# EasyEDA Pro project ProPrj_LM324前级放大TDA2030A双电源功放.epro

# Schematic Schematic1
Board Name: Board1; Create Date: 2025-03-01; Page Name: P1; Project Name: 模电实验功放000; Schematic Name: Schematic1; Update Date: 2025-03-10; Company: 嘉立创EDA; Page Size: A4; Version: V1.0
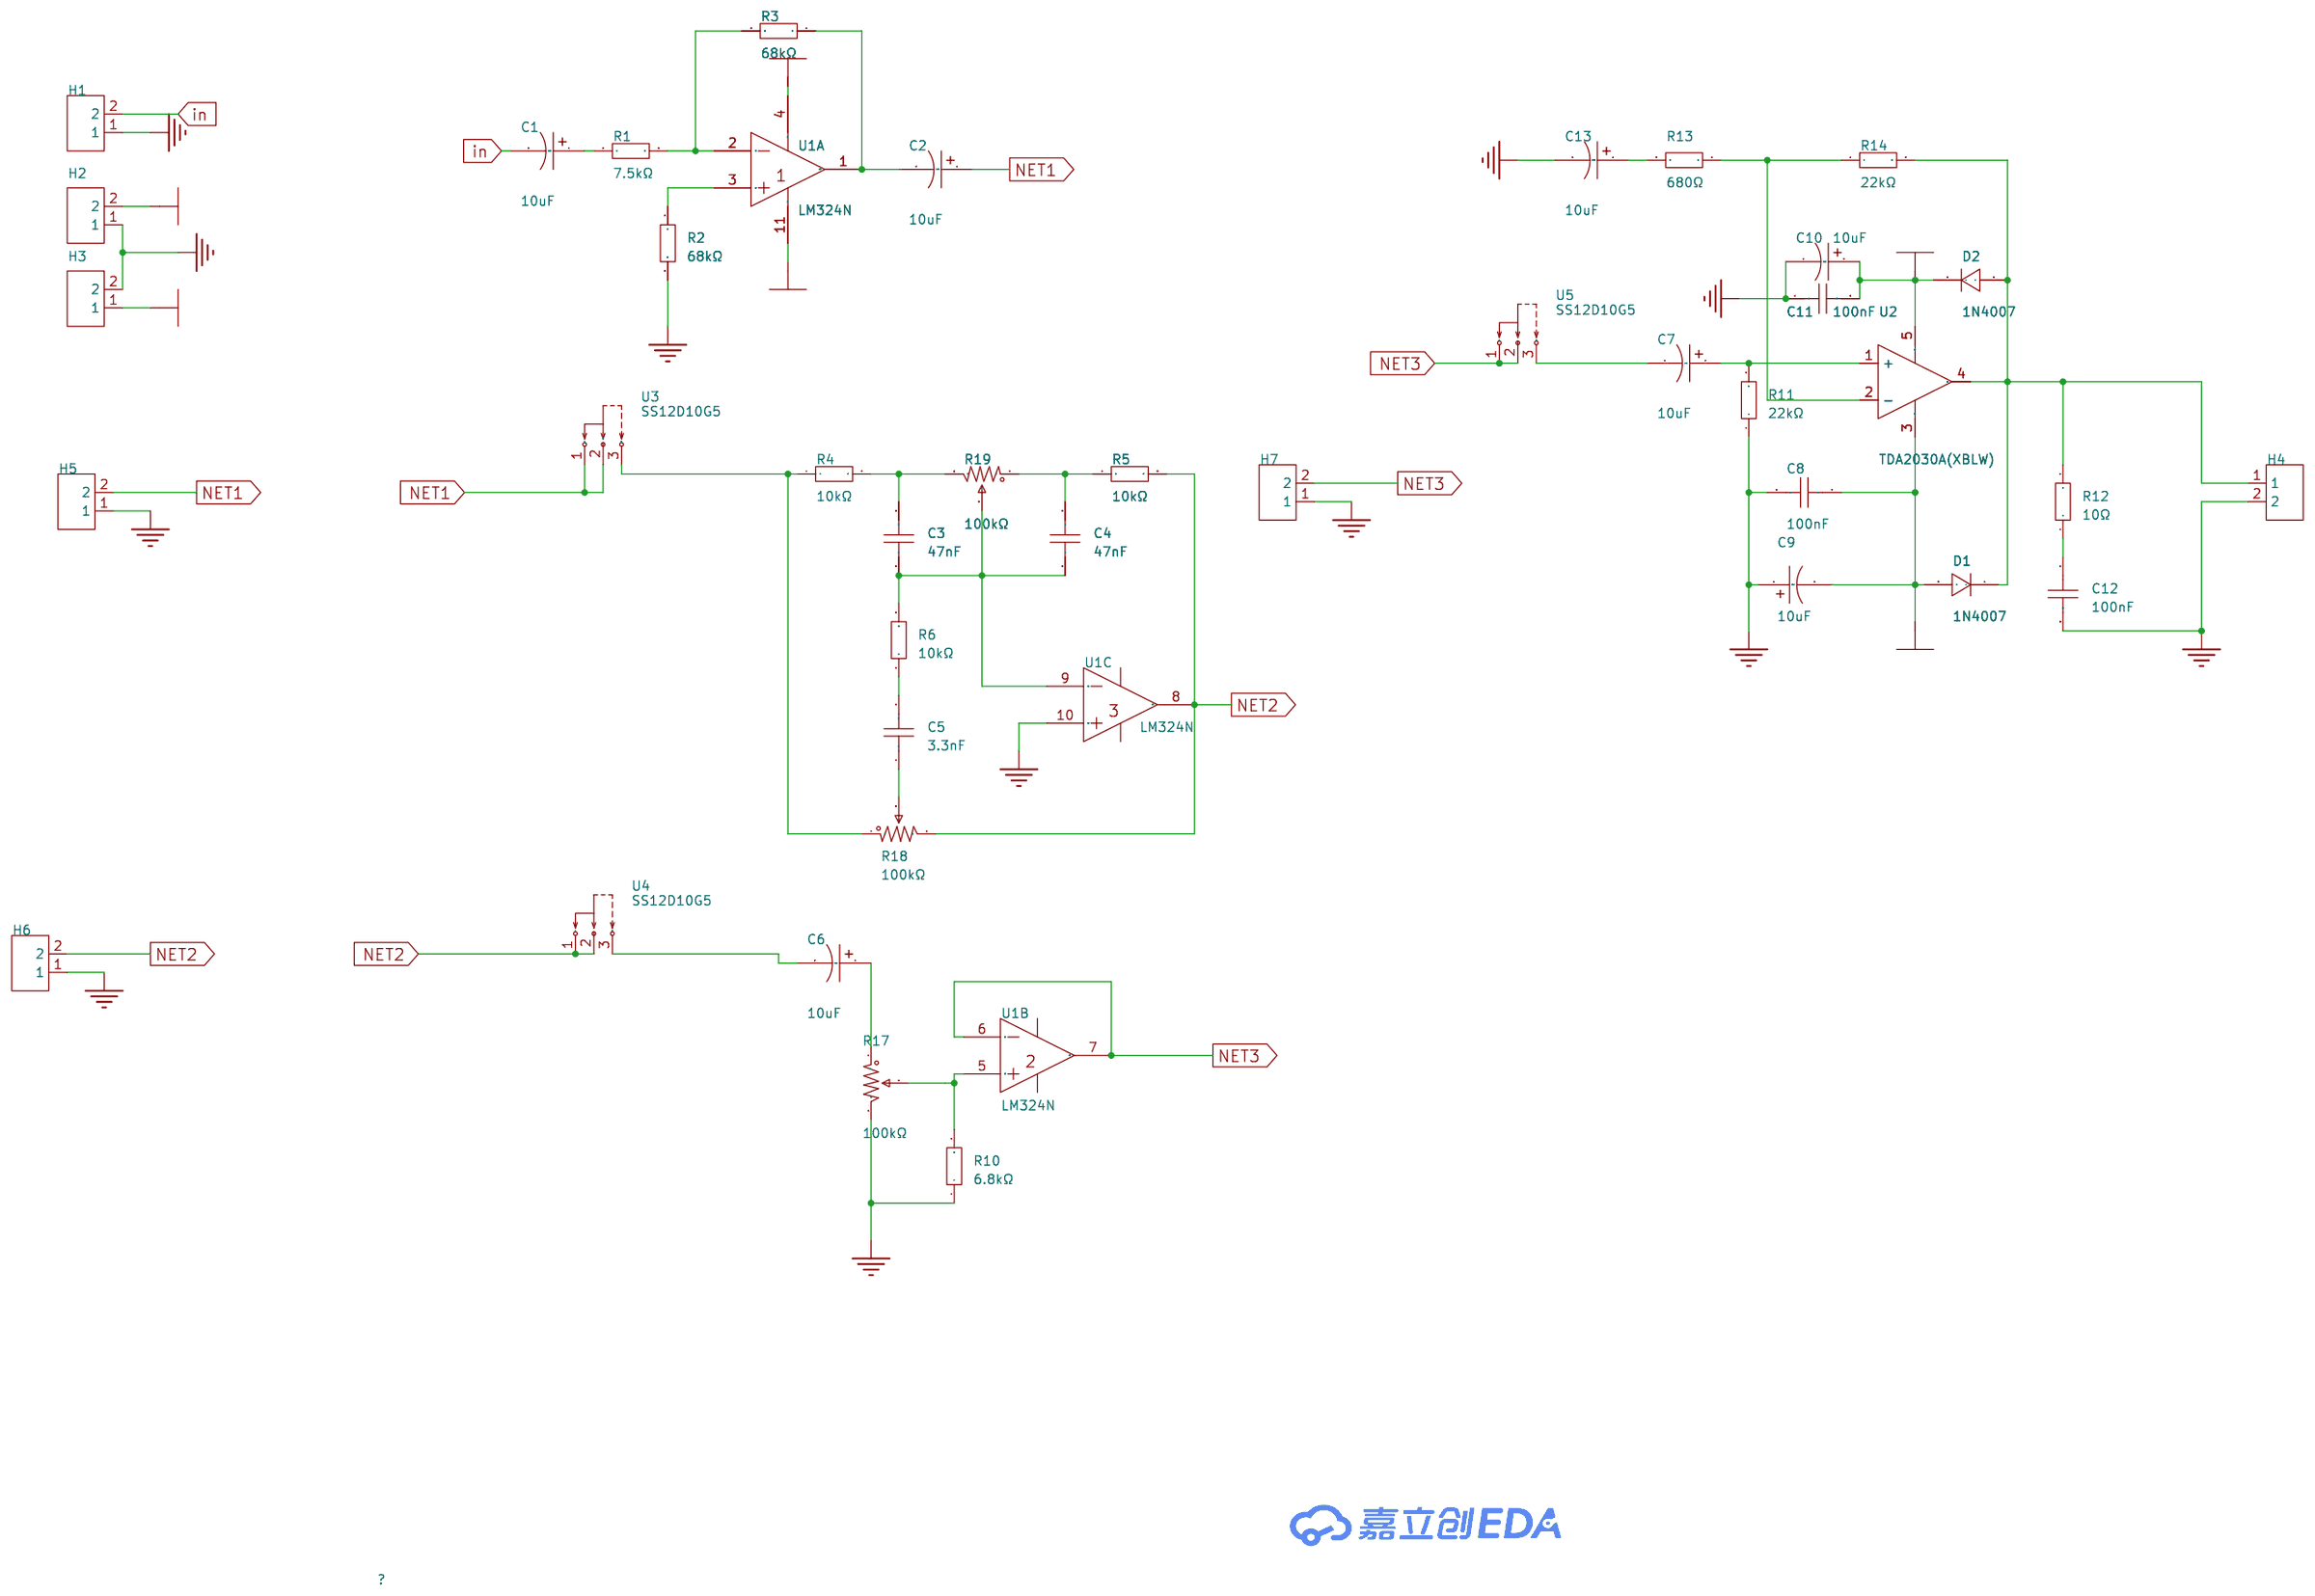
[diagram p0: schematic sheet]

## Parts
C1  10uF  [CAP-TH_BD5.0-P2.00-D0.8-FD]
C2  10uF  [CAP-TH_BD5.0-P2.00-D0.8-FD]
C3  47nF  [CAP-TH_L4.0-W2.6-P5.08-D0.5]
C4  47nF  [CAP-TH_L4.0-W2.6-P5.08-D0.5]
C5  3.3nF  [CAP-TH_L8.5-W5.0-P5.00-D1.2]
C6  10uF  [CAP-TH_BD5.0-P2.00-D0.8-FD]
C7  10uF  [CAP-TH_BD5.0-P2.00-D0.8-FD]
C8  100nF  [CAP-TH_L4.8-W2.4-P5.08-D0.6]
C9  10uF  [CAP-TH_BD5.0-P2.00-D0.8-FD]
C10  10uF  [CAP-TH_BD5.0-P2.00-D0.8-FD]
C11  100nF  [CAP-TH_L4.8-W2.4-P5.08-D0.6]
C12  100nF  [CAP-TH_L4.8-W2.4-P5.08-D0.6]
C13  10uF  [CAP-TH_BD5.0-P2.00-D0.8-FD]
D1  1N4007  [RES-TH_BD2.7-L6.2-P10.20-D0.4]
D2  1N4007  [RES-TH_BD2.7-L6.2-P10.20-D0.4]
H1  PZ254V-11-02P  [HDR-TH_2P-P2.54-V-M]
H2  PZ254V-11-02P  [HDR-TH_2P-P2.54-V-M]
H3  PZ254V-11-02P  [HDR-TH_2P-P2.54-V-M]
H4  PZ254V-11-02P  [HDR-TH_2P-P2.54-V-M]
H5  PZ254V-11-02P  [HDR-TH_2P-P2.54-V-M]
H6  PZ254V-11-02P  [HDR-TH_2P-P2.54-V-M]
H7  PZ254V-11-02P  [HDR-TH_2P-P2.54-V-M]
R1  7.5kΩ  [RES-TH_BD2.3-L3.7-P7.70-D0.9]
R2  68kΩ  [RES-TH_BD2.2-L6.5-P10.50-D0.6]
R3  68kΩ  [RES-TH_BD2.2-L6.5-P10.50-D0.6]
R4  10kΩ  [RES-TH_BD2.7-L6.2-P10.20-D0.4]
R5  10kΩ  [RES-TH_BD2.7-L6.2-P10.20-D0.4]
R6  10kΩ  [RES-TH_BD2.7-L6.2-P10.20-D0.4]
R10  6.8kΩ  [RES-TH_BD2.7-L6.2-P10.20-D0.4]
R11  22kΩ  [RES-TH_BD2.3-L3.7-P7.70-D0.9]
R12  10Ω  [RES-TH_BD2.3-L3.7-P7.70-D0.9]
R13  680Ω  [RES-TH_BD2.3-L3.7-P7.70-D0.9]
R14  22kΩ  [RES-TH_BD2.3-L3.7-P7.70-D0.9]
R17  100kΩ  [RES-ADJ-TH_3362P]
R18  100kΩ  [RES-ADJ-TH_3362P]
R19  100kΩ  [RES-ADJ-TH_3362P]
U1  LM324N  [DIP-14_L19.4-W6.4-P2.54-LS7.6-BL]  (sections 1,2,3)
U2  TDA2030A(XBLW)  [TO-220-5_L10.5-W15.5-P1.70-TL]
U3  SS12D10G5  [SW-TH_SHOU-HAN_SS12D10G4]
U4  SS12D10G5  [SW-TH_SHOU-HAN_SS12D10G4]
U5  SS12D10G5  [SW-TH_SHOU-HAN_SS12D10G4]

## Library data of the parts
C1 C2 C6 C7 C9 C10 C13 = ERS1HM100D11OT: 容值:10uF;精度:±20%;额定电压:50V;; LCSC Part Name: 10uF ±20% 50V; Supplier Part: C106654; Manufacturer: AISHI(艾华集团); Supplier Footprint: 插件,D5xL11mm; JLCPCB Part Class: Extended Part; Datasheet: https://atta.szlcsc.com/upload/public/pdf/source/20191015/C438940_4B8E60A742BB0AE40DDEF87A5C89089D.pdf; Supplier: LCSC; Tolerance: ±20%; Rated Voltage: 50V; Lead Spacing: 2mm; φD: 5mm; L: 11mm; Lifetime @ Temp: 5000hrs@105℃; Equivalent Series Resistance(ESR): 500mΩ@100kHz; Operating Temperature: -55℃~+105℃
C3 C4 = CD1H473KC9BER1E100: 容值:47nF;精度:±10%;额定电压:50V;温度系数:X7R;; LCSC Part Name: 47nF ±10% 50V; Supplier Part: C19712483; Manufacturer: Dersonic(德尔创); Supplier Footprint: 插件,P=5.08mm; JLCPCB Part Class: Extended Part; Datasheet: https://atta.szlcsc.com/upload/public/pdf/source/20231222/1AD6C5910103EA7ED9DC4C331866E9F8.pdf; Supplier: LCSC; Tolerance: ±10%; Voltage Rated: 50V; Temperature Coefficient: X7R
C5 = CT4-0805B332K500F3: 容值:3.3nF;精度:±10%;额定电压:50V;温度系数:X7R;; LCSC Part Name: 3.3nF ±10% 50V; Supplier Part: C94707; Manufacturer: FH(风华); Supplier Footprint: 插件,P=5.08mm; JLCPCB Part Class: Extended Part; Datasheet: https://atta.szlcsc.com/upload/public/pdf/source/20190402/C385200_059806A6312B28FF1421A2413EB641E1.pdf; Supplier: LCSC; Tolerance: ±10%; Voltage Rated: 50V; Temperature Coefficient: X7R
C8 C11 C12 = 178MU0013: 容值:100nF;精度:±10%;额定电压:50V;温度系数:X7R;; LCSC Part Name: 100nF ±10% 50V; Supplier Part: C5632437; Manufacturer: KNSCHA(科尼盛); Supplier Footprint: 插件,P=5.08mm; JLCPCB Part Class: Extended Part; Datasheet: https://atta.szlcsc.com/upload/public/pdf/source/20230506/C9B890CA552EFD22DFE029978FA4CE55.pdf; Supplier: LCSC; Tolerance: ±10%; Voltage Rated: 50V; Temperature Coefficient: X7R
D1 D2 = 1N4007_C360242: 二极管配置:独立式;正向压降(Vf):1V@1A;直流反向耐压(Vr):1kV;平均整流电流(Io):1A;; LCSC Part Name: 电压:1kV 电流:1A; Supplier Part: C360242; Manufacturer: PINGWEI(平伟); Supplier Footprint: DO-41; JLCPCB Part Class: Extended Part; Datasheet: https://atta.szlcsc.com/upload/public/pdf/source/20190311/C360242_0570B0757C9812815F2FE32FDEDB861A.pdf; Supplier: LCSC; Diode Configuration: 独立式; Forward Voltage (Vf@If): 1V@1A; Reverse Voltage (Vr): 1kV; Average Rectified Current (Io): 1A; Reverse Leakage Current: 5uA@1kV
H1-H7 = PZ254V-11-02P: 插针结构:1x2P;间距:2.54mm;行距:-;圆针/方针:方针;安装方式:直插;排数:单排;总PIN位数:2P;额定电流:-;额定电压:-;配合针长度:6mm;塑高:2.5mm;端接针长度:3mm;触头材质:黄铜;触头镀层:-;工作温度:-40℃~+105℃;颜色:黑色;; LCSC Part Name: 1x2P 间距:2.54mm 方针 直插; Supplier Part: C492401; Manufacturer: XFCN(兴飞); Supplier Footprint: 插件,P=2.54mm; JLCPCB Part Class: 扩展库; Datasheet: https://atta.szlcsc.com/upload/public/pdf/source/20200309/C492401_A812433581A9B211A7FFA413ADDFF0E5.pdf; Supplier: LCSC; Pin Structure: 1x2P; Pitch: 2.54mm; Circluar Pins/Square Pins: 方针; Mounting Type: 直插; Number of Rows: 单排; Number of Pins: 2P; Length of Mating Pin: 6mm; Insulation Height: 2.5mm; Length of End Connection Pin: 3mm; Contact Material: 黄铜; Operating Temperature: -40℃~+105℃; Color: 黑色
R1 = MF1/8W-7K5±1%-ST52: 电阻类型:金属膜电阻;阻值:7.5kΩ;精度:±1%;功率:125mW;温度系数:±100ppm/℃;; LCSC Part Name: 金属膜电阻 7.5kΩ ±1% 125mW; Supplier Part: C2903370; Manufacturer: VO(翔胜); Supplier Footprint: 插件,D2.3xL3.7mm; JLCPCB Part Class: Extended Part; Datasheet: https://atta.szlcsc.com/upload/public/pdf/source/20200609/C601728_5AA4C0C8E12E11069DA2C3356F29D1F2.pdf; Supplier: LCSC; Type: 金属膜电阻; Tolerance: ±1%; Overload Voltage (Max): 200V; Power(Watts): 125mW; Temperature Coefficient: ±100ppm/℃; Operating Temperature Range: -55℃~+155℃
R2 R3 = MF1/4W-68K ±1%-ST52: 电阻类型:金属膜电阻;阻值:68kΩ;精度:±1%;功率:250mW;温度系数:±350ppm/℃;; LCSC Part Name: 金属膜电阻 68kΩ ±1% 250mW; Supplier Part: C337161; Manufacturer: VO(翔胜); Supplier Footprint: 插件,D2.7xL6.2mm; JLCPCB Part Class: Extended Part; Datasheet: https://atta.szlcsc.com/upload/public/pdf/source/20181214/C337186_A148C7E222202906AB7599B538FD7985.pdf; Supplier: LCSC; Type: 金属膜电阻; Tolerance: ±1%; Overload Voltage (Max): 250V; Power(Watts): 250mW; Temperature Coefficient: ±350ppm/℃; Operating Temperature Range: -55℃~+155℃
R4-R6 = MF1/4W-10K±1%-ST52: 电阻类型:金属膜电阻;阻值:10kΩ;精度:±1%;功率:250mW;温度系数:±100ppm/℃;; LCSC Part Name: 金属膜电阻 10kΩ ±1% 250mW; Supplier Part: C2903232; Manufacturer: VO(翔胜); Supplier Footprint: 插件,D2.7xL6.2mm; JLCPCB Part Class: Extended Part; Datasheet: https://atta.szlcsc.com/upload/public/pdf/source/20200609/C601728_5AA4C0C8E12E11069DA2C3356F29D1F2.pdf; Supplier: LCSC; Type: 金属膜电阻; Tolerance: ±1%; Overload Voltage (Max): 250V; Power(Watts): 250mW; Temperature Coefficient: ±100ppm/℃; Operating Temperature Range: -55℃~+155℃
R10 = CR1/4W-6K8±5%-ST26: 电阻类型:碳膜电阻;阻值:6.8kΩ;精度:±5%;功率:250mW;温度系数:±350ppm/℃;; LCSC Part Name: 碳膜电阻 6.8kΩ ±5% 250mW; Supplier Part: C2896892; Manufacturer: VO(翔胜); Supplier Footprint: 插件,D2.7xL6.2mm; JLCPCB Part Class: Extended Part; Datasheet: https://atta.szlcsc.com/upload/public/pdf/source/20210803/C2857407_45FF53FE186CAB545115AD37303966CD.pdf; Supplier: LCSC; Type: 碳膜电阻; Tolerance: ±5%; Overload Voltage (Max): 250V; Power(Watts): 250mW; Temperature Coefficient: ±350ppm/℃; Operating Temperature Range: -55℃~+155℃
R11 R14 = MF1/8W ±1% 22K OTB5: 电阻类型:金属膜电阻;阻值:22kΩ;精度:±1%;温度系数:±100ppm/℃;; LCSC Part Name: 金属膜电阻 22kΩ ±1%; Supplier Part: C337062; Manufacturer: VO(翔胜); Supplier Footprint: 插件,D2.3xL3.7mm; JLCPCB Part Class: Extended Part; Datasheet: https://atta.szlcsc.com/upload/public/pdf/source/20181214/C337186_A148C7E222202906AB7599B538FD7985.pdf; Supplier: LCSC; Type: 金属膜电阻; Tolerance: ±1%; Temperature Coefficient: ±100ppm/℃; Power(Watts): 100mW; Overload Voltage (Max): 75V; Operating Temperature Range: -55℃~+155℃
R12 = MF1/8W-10Ω±1%-OT52: 电阻类型:金属膜电阻;阻值:10Ω;精度:±1%;功率:125mW;温度系数:±350ppm/℃;; LCSC Part Name: 金属膜电阻 10Ω ±1% 125mW; Supplier Part: C2848559; Manufacturer: VO(翔胜); Supplier Footprint: 插件,D2.3xL3.7mm; JLCPCB Part Class: Extended Part; Datasheet: https://atta.szlcsc.com/upload/public/pdf/source/20190910/C427326_62A6D058BC0FF74963A2F22379CA06CE.pdf; Supplier: LCSC; Type: 金属膜电阻; Tolerance: ±1%; Overload Voltage (Max): 200V; Power(Watts): 125mW; Temperature Coefficient: ±350ppm/℃; Operating Temperature Range: -55℃~+155℃; Voltage-Supply(Max): 500V; Operating Temperature: -55℃~+155℃
R13 = MF1/8W-680Ω±1%-ST52: 电阻类型:金属膜电阻;阻值:680Ω;精度:±1%;功率:125mW;温度系数:±350ppm/℃;; LCSC Part Name: 金属膜电阻 680Ω ±1% 125mW; Supplier Part: C2848573; Manufacturer: VO(翔胜); Supplier Footprint: 插件,D2.3xL3.7mm; JLCPCB Part Class: Extended Part; Datasheet: https://atta.szlcsc.com/upload/public/pdf/source/20200609/C601728_5AA4C0C8E12E11069DA2C3356F29D1F2.pdf; Supplier: LCSC; Type: 金属膜电阻; Tolerance: ±1%; Overload Voltage (Max): 200V; Power(Watts): 125mW; Temperature Coefficient: ±350ppm/℃; Operating Temperature Range: -55℃~+155℃
R17-R19 = 3362P-1-104: 阻值:100kΩ;精度:±10%;; LCSC Part Name: 100kΩ ±10%; Supplier Part: C118966; Manufacturer: BOCHEN(博晨); Supplier Footprint: 插件; JLCPCB Part Class: Extended Part; Datasheet: https://atta.szlcsc.com/upload/public/pdf/source/20171114/C118966_15106326666201117452.pdf; Supplier: LCSC; Tolerance: ±10%; Power(Watts): 100mW
U1 = LM324N_C725320: 运放类型:-;放大器组数:-;增益带宽积（GBP）:-;压摆率（SR）:-;电源电压:-;各通道供电电流:-;; LCSC Part Name: 四路运算放大器; Supplier Part: C725320; Manufacturer: HGSEMI(华冠); Supplier Footprint: DIP-14; JLCPCB Part Class: Extended Part; Datasheet: https://atta.szlcsc.com/upload/public/pdf/source/20200820/C725320_F412C3792749730AA8E5D3FBC02E9B6A.pdf; Supplier: LCSC
U2 = TDA2030A(XBLW): 音频功率放大器   18W音频放大器，工作电压：44V，输出电流4.5A; Supplier Part: C19267476; Manufacturer: XBLW(芯伯乐); Supplier Footprint: TO-220B; JLCPCB Part Class: Extended Part; Datasheet: https://atta.szlcsc.com/upload/public/pdf/source/20231127/7A1903075705428C96FAEB39CDCE1C16.pdf; Supplier: LCSC; Supply Voltage: 44V; Type of Power Amplifier: AB类功放; Speaker Channels: 单声道; Output Power: 12Wx1@8Ω; Type: Class AB; Output Type: 1-Channel (Mono); Max Output Power x Channels @ Load: 12W x 1 @ 8Ω; Voltage - Supply: ±6V ~ 22V; Features: 热保护,短路保护
U3-U5 = SS12D10G5: 电路结构:单刀双掷;安装方式:直插;额定电流(DC):2A;额定电压(DC):125V;机械寿命:3千次;; LCSC Part Name: 两档立式插件 3脚拨动开关 柄长5.0mm; Supplier Part: C7431054; Manufacturer: SHOU HAN(首韩); Supplier Footprint: 插件; JLCPCB Part Class: 扩展库; Datasheet: https://atta.szlcsc.com/upload/public/pdf/source/20231130/7A3DB6A149BF0A1DCFFE64FFC07FE434.pdf; Supplier: LCSC; Circuit: 单刀双掷; Switch Length: 12.7mm; Switch Width: 6.7mm; Mounting Style: 直插; Current Rating (DC): 2A; Voltage Rating (DC): 125V; Mechanical Life: 3千次; Operating Temperature: -25℃~+70℃

## Nets
+VCC: C10.1 C11.2 D2.1(-) H2.2 U1.4(VCC) U2.5(VCC+)
-VCC: C8.1 C9.2 D1.2(+) H3.1 U1.11(GND) U2.3(GND)
GND: C8.2 C9.1 C10.2 C11.1 C12.2 C13.2 H1.1 H2.1 H3.2 H4.2 H5.1 H6.1 H7.1 R2.2 R10.1 R11.1 R17.3 U1.10(IN3+)
in: C1.2 H1.2
NET1: C2.1 H5.2 U3.1 U3.2
NET2: H6.2 R5.2 R18.3 U1.8(OUT3) U4.1 U4.2
NET3: H7.2 U1.6(IN2-) U1.7(OUT2) U5.1 U5.2
$1N348: C1.1 R1.1
$1N650: R1.2 R3.2 U1.2(IN1-)
$1N654: R2.1 U1.3(IN1+)
$1N821: C2.2 R3.1 U1.1(OUT1)
$1N1229: C3.2 R4.2 R19.3
$1N1242: C4.2 R5.1 R19.1
$1N1256: C3.1 C4.1 R6.2 R19.2 U1.9(IN3-)
$1N1304: C5.2 R6.1
$1N1344: C5.1 R18.2
$1N1555: C6.1 R17.1
$1N1559: R10.2 R17.2 U1.5(IN2+)
$1N1804: C7.1 R11.2 U2.1(+)
$1N2266: D1.1(-) D2.2(+) H4.1 R12.2 R14.2 U2.4(OUT)
$1N2512: C12.1 R12.1
$1N2874: R13.1 R14.1 U2.2(-)
$1N2999: C13.1 R13.2
$1N10218: R4.1 R18.1 U3.3
$1N10480: C6.2 U4.3
$1N10637: C7.2 U5.3

# Board PCB1
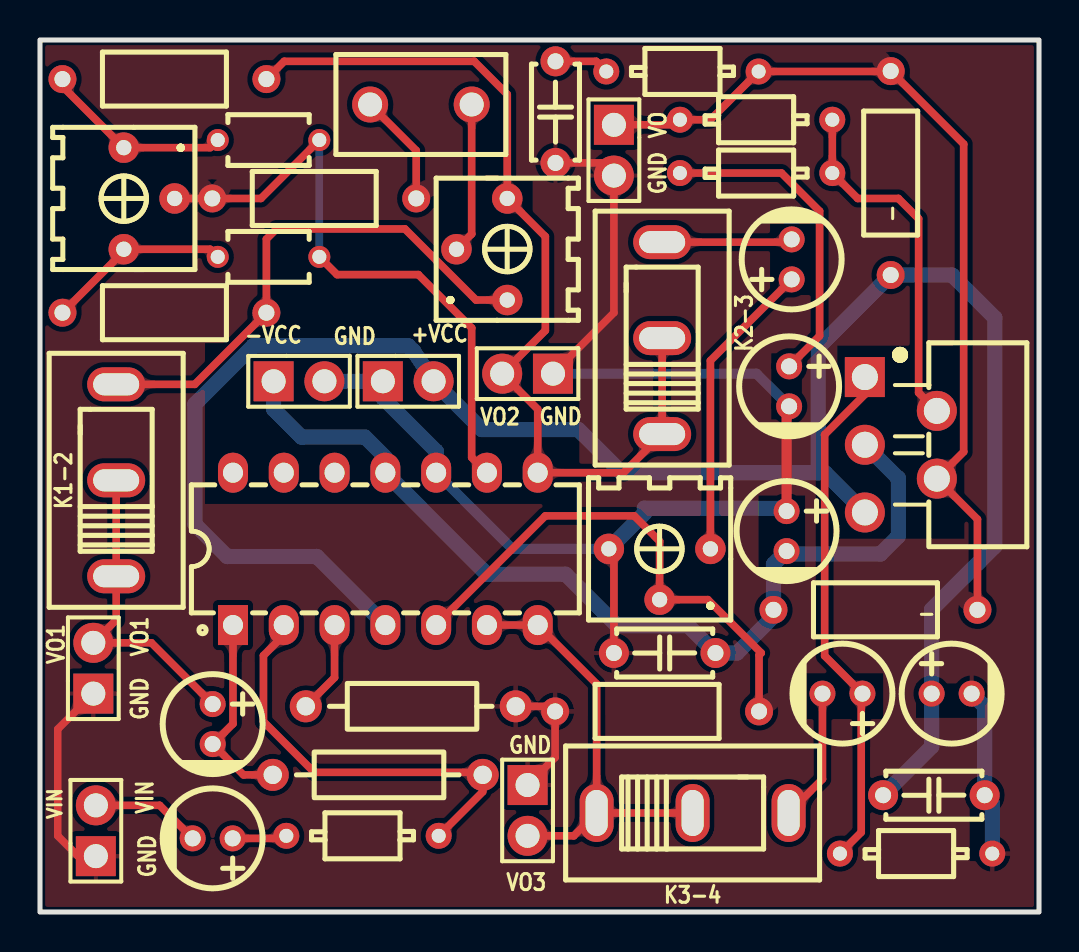
[diagram p1: board, top side]
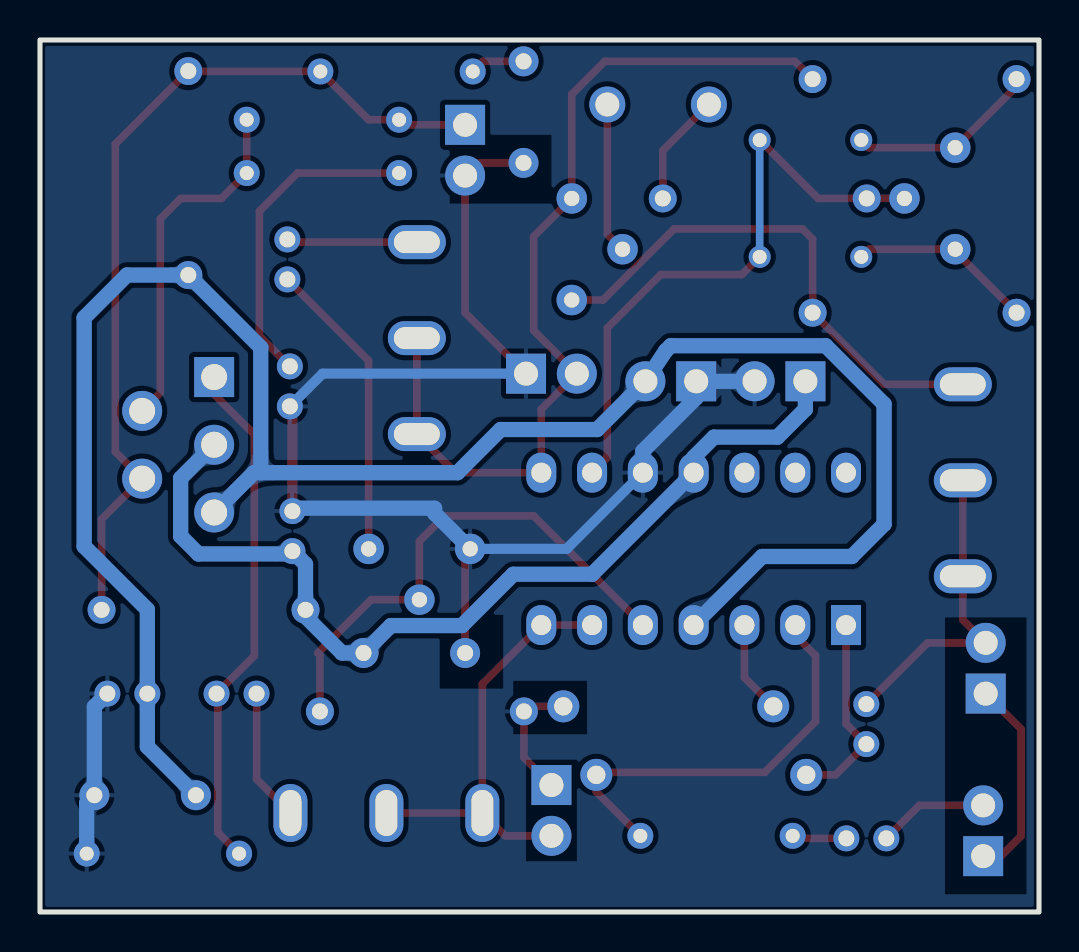
[diagram p2: board, bottom side, seen from below]

Outline 49.96 x 43.61 mm; copper layers: Top Layer, Bottom Layer. Coordinates in mm from the lower left corner of the outline.
Outline path: rectangle 0,43.61 49.96,0
Stack: Top Layer 0.035mm / Dielectric1 1.51mm FR4 er 4.5 / Bottom Layer 0.035mm

## Design rules (mm)
template: JLCPCB Capability(Two Layers Board)
spacing copperThickness1oz (default): track to track 0.102, other pairs 0.152 to 0.3
spacing copperThickness2oz: track to track 0.203, other pairs 0.152 to 0.3
track width copperThickness1oz (default): min 0.127, default 0.254, max 2.54
track width copperThickness2oz: min 0.203, default 0.254, max 2.54
differential pair differentialPair (default): width min 0.127, default 0.254, max 2.54; gap min 0.152, default 0.152
via viaSize (default): diameter min 0.5, default 0.61, max 10; hole min 0.3, default 0.305, max 6.3

## Placement (name value [footprint] x y rotation side)
C1  10uF  [CAP-TH_BD5.0-P2.00-D0.8-FD]  8.64 3.68 180 top
C2  10uF  [CAP-TH_BD5.0-P2.00-D0.8-FD]  8.64 9.4 270 top
C3  47nF  [CAP-TH_L4.0-W2.6-P5.08-D0.5]  11.43 32.77 180 top
C4  47nF  [CAP-TH_L4.0-W2.6-P5.08-D0.5]  11.43 38.61 180 top
C5  3.3nF  [CAP-TH_L8.5-W5.0-P5.00-D1.2]  19.05 40.39 180 top
C6  10uF  [CAP-TH_BD5.0-P2.00-D0.8-FD]  37.59 32.64 90 top
C7  10uF  [CAP-TH_BD5.0-P2.00-D0.8-FD]  40.13 10.92 180 top
C8  100nF  [CAP-TH_L4.8-W2.4-P5.08-D0.6]  31.24 12.95 180 top
C9  10uF  [CAP-TH_BD5.0-P2.00-D0.8-FD]  37.34 19.05 270 top
C10  10uF  [CAP-TH_BD5.0-P2.00-D0.8-FD]  45.59 10.92 0 top
C11  100nF  [CAP-TH_L4.8-W2.4-P5.08-D0.6]  44.7 5.84 180 top
C12  100nF  [CAP-TH_L4.8-W2.4-P5.08-D0.6]  25.78 40.01 270 top
C13  10uF  [CAP-TH_BD5.0-P2.00-D0.8-FD]  37.47 26.29 270 top
D1  1N4007  [RES-TH_BD2.7-L6.2-P10.20-D0.4]  41.78 15.11 180 top
D2  1N4007  [RES-TH_BD2.7-L6.2-P10.20-D0.4]  42.54 36.96 90 top
H2  PZ254V-11-02P  [HDR-TH_2P-P2.54-V-M]  18.41 26.54 0 top
H3  PZ254V-11-02P  [HDR-TH_2P-P2.54-V-M]  12.95 26.54 0 top
H4  PZ254V-11-02P  [HDR-TH_2P-P2.54-V-M]  28.7 38.1 270 top
H6  PZ254V-11-02P  [HDR-TH_2P-P2.54-V-M]  24.38 26.92 180 top
H7  PZ254V-11-02P  [HDR-TH_2P-P2.54-V-M]  24.38 5.08 270 top
NOREF  -  [HDR-TH_2P-P2.54-V-M]  2.67 12.19 90 top
R1  7.5kΩ  [RES-TH_BD2.3-L3.7-P7.70-D0.9]  16.13 3.81 0 top
R2  68kΩ  [RES-TH_BD2.2-L6.5-P10.50-D0.6]  18.54 10.29 0 top
R3  68kΩ  [RES-TH_BD2.2-L6.5-P10.50-D0.6]  16.89 6.86 0 top
R4  10kΩ  [RES-TH_BD2.7-L6.2-P10.20-D0.4]  6.22 29.97 180 top
R5  10kΩ  [RES-TH_BD2.7-L6.2-P10.20-D0.4]  6.22 41.66 0 top
R6  10kΩ  [RES-TH_BD2.7-L6.2-P10.20-D0.4]  13.72 35.69 180 top
R10  6.8kΩ  [RES-TH_BD2.7-L6.2-P10.20-D0.4]  30.86 10.03 0 top
R11  22kΩ  [RES-TH_BD2.3-L3.7-P7.70-D0.9]  43.81 2.92 180 top
R12  10Ω  [RES-TH_BD2.3-L3.7-P7.70-D0.9]  32.13 42.04 0 top
R13  680Ω  [RES-TH_BD2.3-L3.7-P7.70-D0.9]  35.81 36.96 180 top
R14  22kΩ  [RES-TH_BD2.3-L3.7-P7.70-D0.9]  35.81 39.62 180 top
R17  100kΩ  [RES-ADJ-TH_3362P]  30.99 16.89 180 top
R18  100kΩ  [RES-ADJ-TH_3362P]  22.1 33.15 90 top
R19  100kΩ  [RES-ADJ-TH_3362P]  5.46 35.69 270 top
U1  LM324N  [DIP-14_L19.4-W6.4-P2.54-LS7.6-BL]  17.27 18.16 0 top
U2  TDA2030A(XBLW)  [TO-220-5_L10.5-W15.5-P1.70-TL]  43.05 23.37 0 top
U3  SS12D10G5  [SW-TH_SHOU-HAN_SS12D10G4]  3.81 21.59 90 top
U4  SS12D10G5  [SW-TH_SHOU-HAN_SS12D10G4]  31.12 28.7 90 top
U5  SS12D10G5  [SW-TH_SHOU-HAN_SS12D10G4]  32.64 4.95 0 top
VIN  PZ254V-11-02P  [HDR-TH_2P-P2.54-V-M]  2.79 4.06 90 top

## Footprints (pads in the part's own frame, mm; a bottom-side part is the same pattern mirrored in y, then rotated)
CAP-TH_BD5.0-P2.00-D0.8-FD
  round 1.3 hole 0.8: 1(-1,0) 2(1,0)
CAP-TH_L4.0-W2.6-P5.08-D0.5
  round 1.1 hole 0.7: 1(-2.54,0) 2(2.54,0)
CAP-TH_L4.8-W2.4-P5.08-D0.6
  round 1.5 hole 0.8: 1(-2.54,0) 2(2.54,0)
CAP-TH_L8.5-W5.0-P5.00-D1.2
  round 1.8 hole 1.2: 1(-2.54,0) 2(2.54,0)
DIP-14_L19.4-W6.4-P2.54-LS7.6-BL
  rect 1.501x1.999 hole 1.001: 1(-7.62,-3.81)
  oval 1.501x1.999 hole 1.001: 2(-5.08,-3.81) 3(-2.54,-3.81) 4(0,-3.81) 5(2.54,-3.81) 6(5.08,-3.81) 7(7.62,-3.81) 8(7.62,3.81) 9(5.08,3.81) 10(2.54,3.81) 11(0,3.81) 12(-2.54,3.81) 13(-5.08,3.81) 14(-7.62,3.81)
HDR-TH_2P-P2.54-V-M
  rect 2x2 hole 1.2: 1(-1.27,0)
  round 2 hole 1.2: 2(1.27,0)
RES-ADJ-TH_3362P
  round 1.524 hole 0.762: 1(-2.54,-1.27) 2(0,1.27) 3(2.54,-1.27)
RES-TH_BD2.2-L6.5-P10.50-D0.6
  round 1.6 hole 0.914: 1(-5.25,0) 2(5.25,0)
RES-TH_BD2.3-L3.7-P7.70-D0.9
  round 1.3 hole 0.7: 1(-3.81,0) 2(3.81,0)
RES-TH_BD2.7-L6.2-P10.20-D0.4
  round 1.4 hole 0.8: 1(-5.1,0) 2(5.1,0)
SW-TH_SHOU-HAN_SS12D10G4
  oval 1.7x2.9 hole 1.1x2.3: 1(-4.8,0) 2(0,0) 3(4.8,0)
TO-220-5_L10.5-W15.5-P1.70-TL
  rect 2x2 hole 1.3: 1(-1.8,3.386)
  round 2 hole 1.3: 2(1.8,1.694) 3(-1.8,0) 4(1.8,-1.694) 5(-1.8,-3.386)

## Nets
As in the schematic, except:
GND: C8.2 C9.1 C10.2 C11.1 C12.2 C13.2 H2.1 H3.2 H4.2 H6.1 H7.1 NOREF.1 R2.2 R10.1 R11.1 R17.3 U1.10 VIN.1
IN: C1.2 VIN.2
NET1: C2.1 NOREF.2 U3.1 U3.2

Pads without a net: U1 12 13 14

## Routing (per net, layer and track width the routed paths; a pad name or vN(x,y) marks a point on that pad's centre or on a via; arc(x,y) is an arc through that point)
+VCC: length 99.6
  Bottom Layer w0.762: C11.2 44.59,8.27 C10.1 44.59,15.13 47.75,18.29 47.75,29.72 45.61,31.86 D2.1 38.92,28.23 38.92,21.97 ; U1.4 13.84,17.78 9.36,17.78 7.75,19.39 7.75,25.4 10.67,28.32 18.41,28.32 18.68,28.06 H2.2 22.1,24.13 26.92,24.13 29.08,21.97 38.92,21.97 ; 38.92,21.97 39.26,21.97 U2.5
-VCC: length 47.5
  Bottom Layer w0.762: H3.1 11.68,25.15 13.08,23.75 16.26,23.75 17.27,22.73 U1.11 22.35,16.89 26.29,16.89 28.85,14.33 32.41,14.33 C8.1 34.86,12.95 36.68,14.78 D1.2 36.68,17.4 C9.2 37.48,17.91 42.04,17.91 42.93,18.8 42.93,21.7 U2.3
GND: length 91.1
  Top Layer w0.381: R2.2 25.51,10.29 R10.1 25.76,7.73 H7.1 ; H6.1 28.7,29.97 H4.2 28.07,37.47 C12.2 ; C8.2 28.7,17.91 R17.3 ; VIN.1 1.91,2.79 0.89,3.81 0.89,9.14 NOREF.1
  Top Layer w0.508: C13.2 37.34,25.16 C9.1
  Bottom Layer w0.508: R17.3 23.62,18.16 U1.10 ; C13.2 35.83,26.92 H6.1
  Bottom Layer w0.762: U1.10 19.81,23.05 17.15,25.72 H2.1 H3.2 ; C10.2 47.24,10.27 C11.1 47.62,5.46 R11.1 ; C9.1 37.19,20.19 30.23,20.19 30.23,19.94 R17.3
IN: length 5.5
  Top Layer w0.381: C1.2 5.98,5.33 VIN.2
NET1: length 15.8
  Top Layer w0.381: C2.1 5.57,13.46 NOREF.2 3.81,14.61 U3.1 U3.2
NET2: length 46.3
  Top Layer w0.381: R5.2 12.21,42.55 21.72,42.55 23.37,40.89 R18.3 25.27,33.78 25.27,29.08 H6.2 24.89,25.15 U1.8 29.18,21.97 U4.1 U4.2
NET3: length 21.9
  Top Layer w0.381: U5.1 U5.2 ; U5.1 26.7,3.81 H7.2 ; U5.1 27.84,11.4 U1.7 U1.6
$1N348: length 2.7
  Top Layer w0.381: C1.1 12.19,3.68 R1.1
$1N650: length 21.3
  Top Layer w0.381: U1.2 12.19,13.84 11.18,12.83 11.18,9.53 13.72,6.99 22.01,6.99 R3.2 22.14,6.01 R1.2
$1N654: length 4.7
  Top Layer w0.381: U1.3 14.73,11.73 R2.1
$1N821: length 10
  Top Layer w0.381: U1.1 9.65,9.41 C2.2 10.18,6.86 R3.1
$1N1229: length 9.3
  Top Layer w0.381: C3.2 8.51,33.15 R19.3 4.19,33.04 R4.2
$1N1242: length 9.6
  Top Layer w0.381: R5.1 1.12,41.3 4.19,38.23 8.51,38.23 C4.2
$1N1256: length 30.9
  Top Layer w0.381: C4.1 11.05,35.69 R6.2 R19.2 ; U1.9 21.59,22.73 21.59,29.21 18.92,31.88 14.86,31.88 C3.1
  Bottom Layer w0.381: C4.1 C3.1
$1N1304: length 5.7
  Top Layer w0.381: R6.1 18.82,38.08 C5.2
$1N1344: length 7.6
  Top Layer w0.381: C5.1 21.59,33.91 R18.2
$1N1555: length 15.2
  Top Layer w0.381: R17.1 33.53,27.58 C6.1
$1N1559: length 26
  Top Layer w0.381: R10.2 35.96,12.85 36.07,12.95 33.4,15.62 R17.2 30.99,18.54 29.72,19.81 25.27,19.81 U1.5
$1N1804: length 25.9
  Top Layer w0.381: R11.2 41.07,3.99 41.07,10.86 C7.1 39.24,12.81 39.24,23.88 41.25,25.89 U2.1
$1N2266: length 44.8
  Top Layer w0.381: H4.1 31.75,39.37 R14.2 33.53,39.62 R12.2 42.53,42.04 D2.2 46.2,38.41 46.2,23.02 U2.4 46.88,19.64 46.88,15.11
$1N2512: length 2.8
  Top Layer w0.381: R12.1 27.81,42.55 C12.1
$1N2874: length 17.9
  Top Layer w0.381: U2.2 43.94,25.97 43.94,34.67 42.93,35.69 40.89,35.69 R13.1 R14.1
$1N2999: length 16.2
  Top Layer w0.381: R13.2 37.08,36.96 38.99,35.05 38.99,28.81 C13.1
$1N10218: length 26.4
  Top Layer w0.381: R18.1 21.81,30.61 18.25,34.16 11.83,34.16 11.32,33.66 R4.1 7.74,26.39 U3.3
$1N10480: length 6.5
  Top Layer w0.381: U4.3 37.46,33.5 C6.2
$1N10637: length 6.7
  Top Layer w0.381: U5.3 39.13,6.65 C7.2

## Copper pours and planes (outline as drawn; the poured copper is in the pictures)
GND on Top Layer: 27.54,19.06 34.76,19.06 34.76,1.6 27.54,1.6
GND on Top Layer: 1.91,12.57 34.76,12.57 34.76,1.6 1.91,1.6
GND on Top Layer: 6.1,17.4 28.96,17.4 28.96,9.78 6.1,9.78
GND on Top Layer: 32.97,8.3 49.96,8.3 49.96,0 32.97,0
GND on Top Layer: 0,43.61 49.96,43.61 49.96,0 0,0
GND on Bottom Layer: 0,43.32 49.81,43.32 49.81,0 0,0

Small or netless copper shapes (teardrops, artwork), in the pictures only: 98 on Top Layer, 24 on Bottom Layer

## Text on the board
Top Silkscreen Layer: VO1 | GND | VIN | -VCC | +VCC | VO2 | K3-4 | - | K1-2 | VO | K2-3 | VO3
